# EAGLE board mf_tray_mb_v9 (EAGLE 8.0.1)
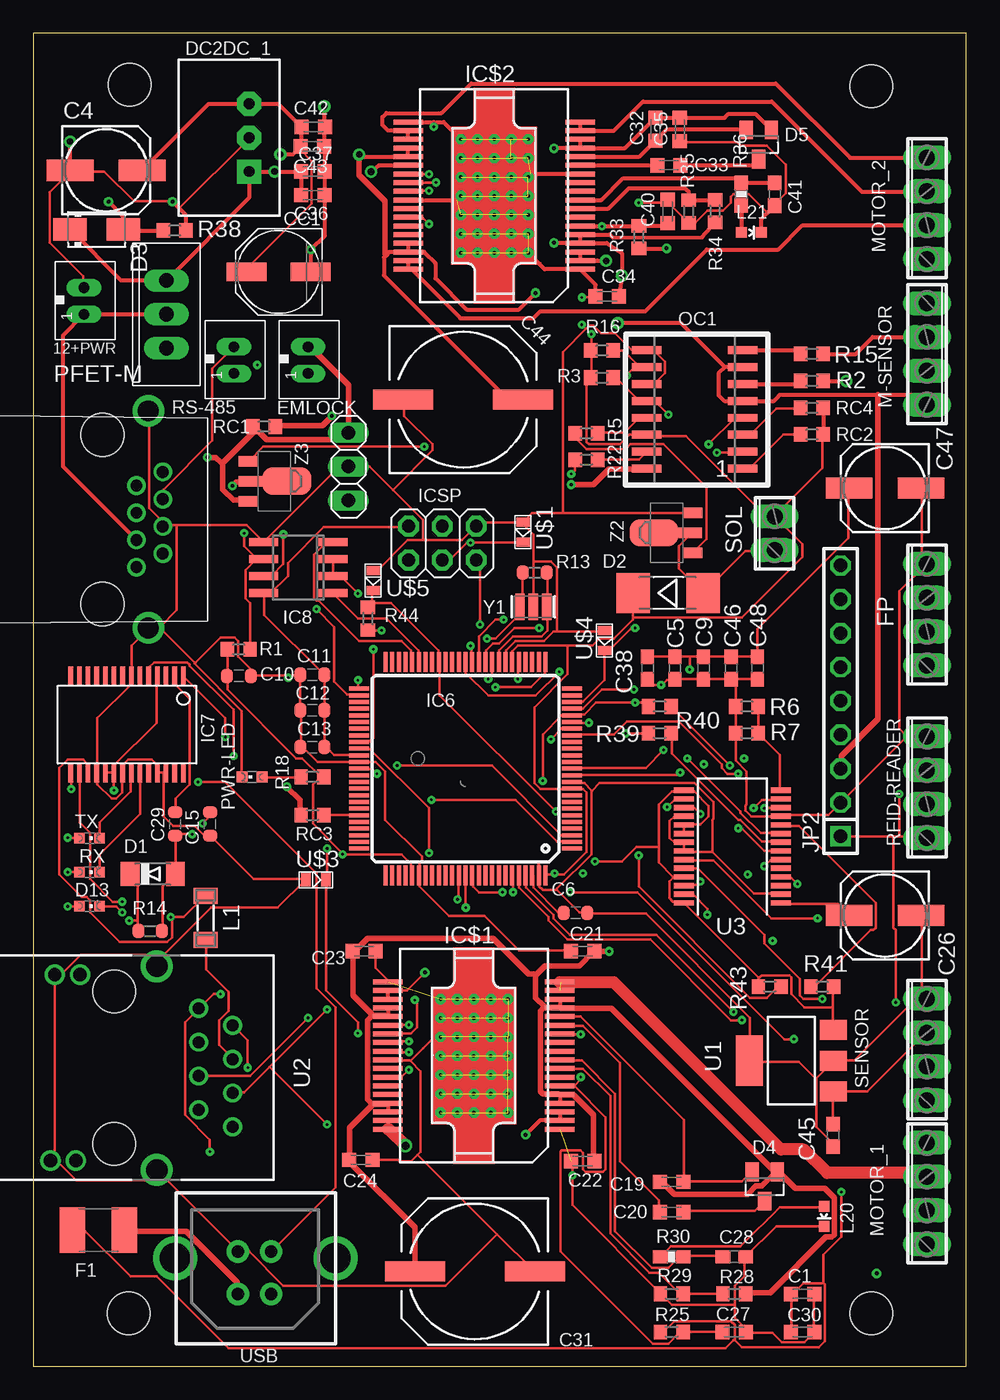
[diagram p8: board, top side]
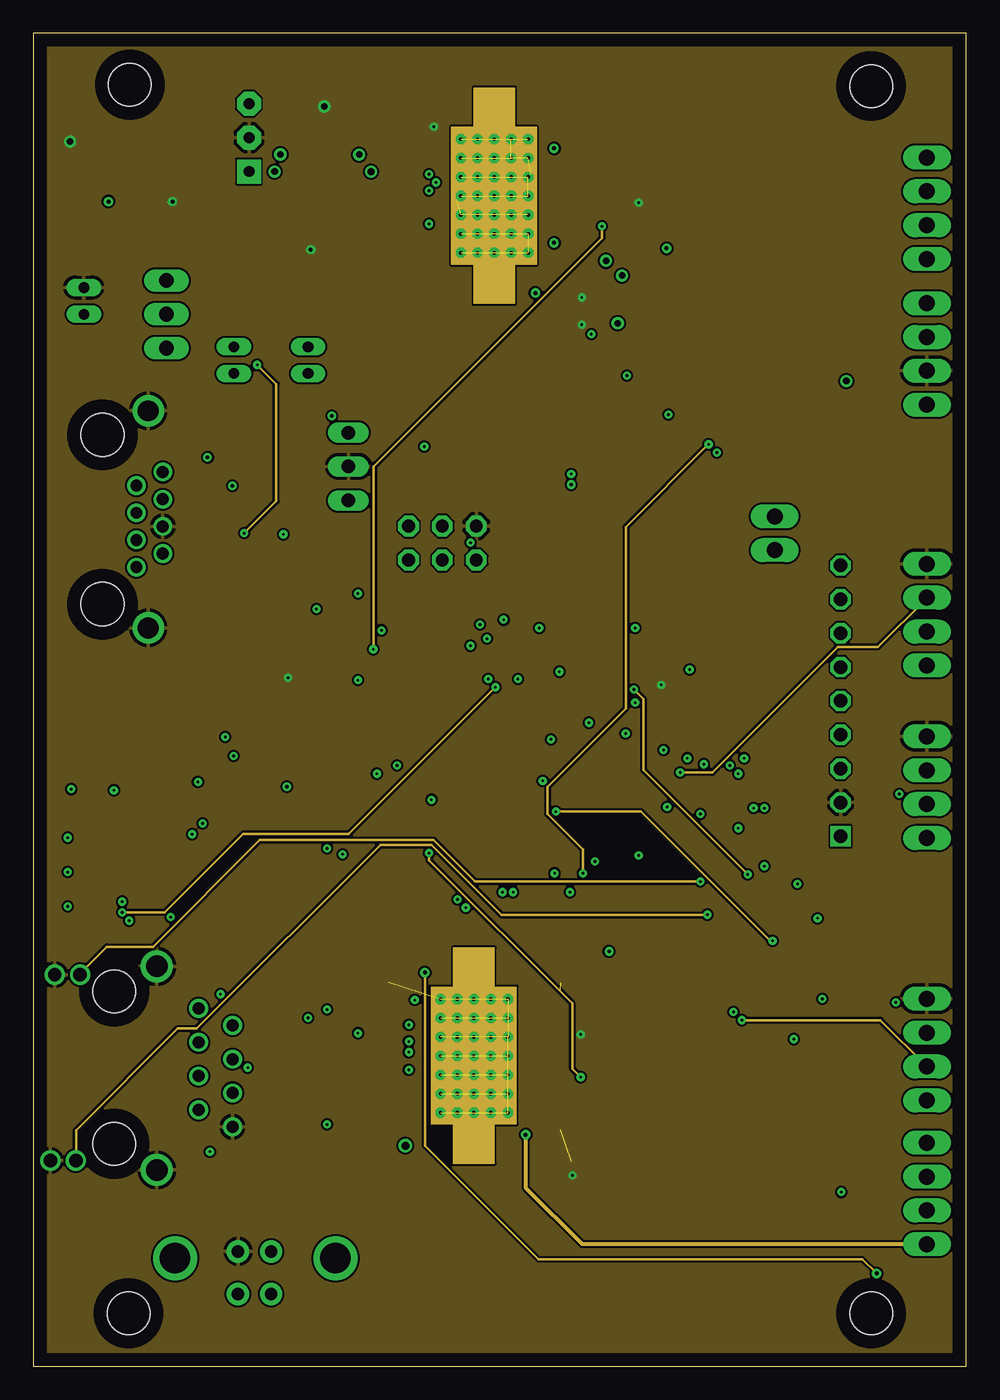
[diagram p9: board, inner layer Route2]
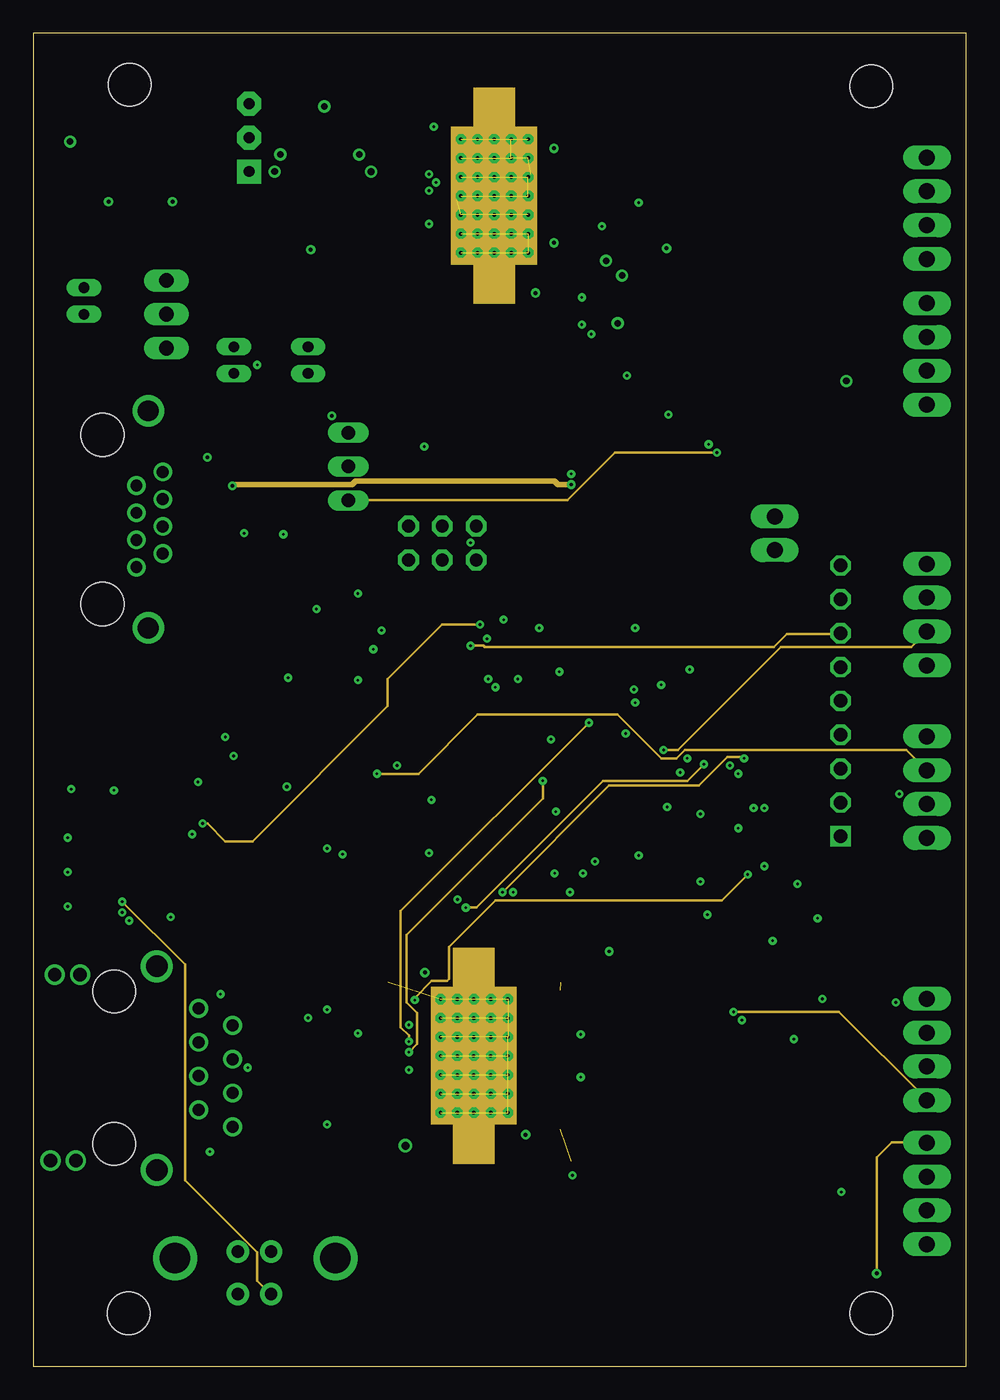
[diagram p10: board, inner layer Route15]
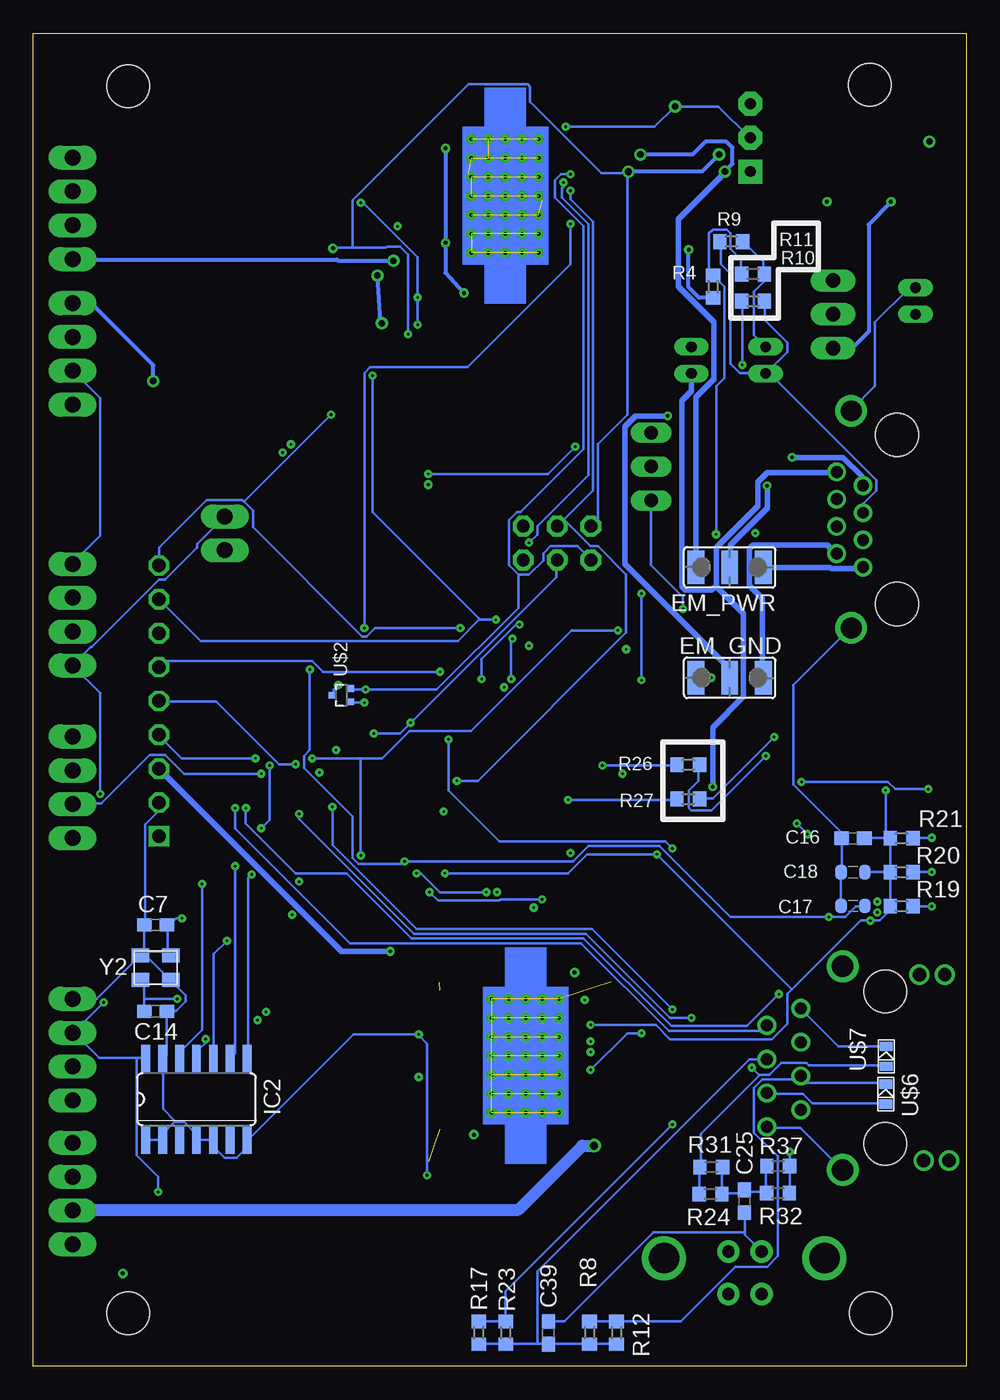
[diagram p11: board, bottom side, seen from below]

Size 70 x 100 mm. Coordinates in mm from the lower left corner, seen from the top.
Outline: 0,0 70,0 70,100 0,100 0,0
Copper layers (1+2*15+16): Top 0.035mm / dielectric 1.5mm / Route2 0.035mm / dielectric 0.15mm / Route15 0.035mm / dielectric 0.2mm / Bottom 0.035mm
Design rules "default *": minimum track width 8mil, minimum drill 8mil, track to track 6mil, track to pad 6mil, pad to pad 6mil, via to via 6mil, smd to smd 6mil, copper to edge 40mil, drill to drill 8mil, minimum pad ring 10mil, minimum via ring 8mil, stop-mask expansion 4mil, vias tented up to drill 0mil, thermal gap 10mil
Net classes: 1 power: width 0.406 mm, drill 0.254 mm, clearance 0.152 mm; 2 Massa: width 1.2 mm, drill 0.6 mm, clearance 0.2 mm; 3 Mot: width 1.2 mm, drill 0.8 mm, clearance 0.005 mm; 4 aref: width 0.305 mm, drill 0.61 mm, clearance 0.254 mm; 5 0.6096: width 0.61 mm, drill 0.406 mm, clearance 0.254 mm; 6 0.900: width 0.9 mm, drill 0.6 mm, clearance 0.5 mm
Holes 3.2 mm at 62.87,96.04 7.14,3.97 62.87,3.97 7.24,96.14

## Footprints (pad centres in the part's own frame; a part is rotated, then mirrored left to right if it is on the bottom)
JST_B2B-PH_HEADER = drill 0.8 long: P1 1.075,0.048; P2 -0.925,0.048
C0603K = smd 1.05 x 1.08: 1 -0.875,0; 2 0.875,0
153CLV-0605 = smd 3.5 x 1.6: + 2.7,0; - -2.7,0
C0603 = smd 1.1 x 1: 1 -0.85,0; 2 0.85,0
C0603-ROUND = smd 0.898 x 1.1: 1 -0.889,0; 2 0.889,0
NIC_10X10.5_CAP = smd 4.5 x 1.5: + 4.5,0; - -4.5,0
PANASONIC_D = smd 3 x 1.4: + 2.4,0; - -2.4,0
MINIMELF = smd 1.4 x 1.8: A 1.7,0; C -1.7,0
MELF-MLL41 = smd 2.5 x 3: A 2.625,0; C -2.625,0
DO214AC = smd 2.5 x 1.7: A 2,0; C -2,0
SOT23 = smd 1 x 1.4: 1 -0.95,-1.1; 2 0.95,-1.1; 3 0,1.1
CHIPLED_0603 = smd 0.8 x 0.8: A 0,-0.75; C 0,0.75
TSR-1 = drill 0.8 pad 1.8 square: 1 -2.54,-1.5 | drill 0.8 pad 1.8 octagon: 2 0,-1.5; 3 2.54,-1.5
SJ_2W = smd 1.27 x 2.54: 1 -2.54,0; 2 0,0; 3 2.54,0
L1812 = smd 1.9 x 3.4: 1 -1.95,0; 2 1.95,0
4POL254 = drill 1.2 long: 1 -3.81,0; 2 -1.27,0; 3 1.27,0; 4 3.81,0
SO14 = smd 0.66 x 2.032: 1 -3.81,-3.073; 2 -2.54,-3.073; 3 -1.27,-3.073; 4 0,-3.073; 5 1.27,-3.073; 6 2.54,-3.073; 7 3.81,-3.073; 8 3.81,3.073; 9 2.54,3.073; 10 1.27,3.073; 11 0,3.073; 12 -1.27,3.073; 13 -2.54,3.073; 14 -3.81,3.073
TQFP100 = smd 1.5 x 0.3: 1 -8,6; 2 -8,5.5; 3 -8,5; 4 -8,4.5; 5 -8,4; 6 -8,3.5; 7 -8,3; 8 -8,2.5; 9 -8,2; 10 -8,1.5; 11 -8,1; 12 -8,0.5; 13 -8,0; 14 -8,-0.5; 15 -8,-1; 16 -8,-1.5; 17 -8,-2; 18 -8,-2.5; 19 -8,-3; 20 -8,-3.5; 21 -8,-4; 22 -8,-4.5; 23 -8,-5; 24 -8,-5.5; 25 -8,-6; 51 8,-6; 52 8,-5.5; 53 8,-5; 54 8,-4.5; 55 8,-4; 56 8,-3.5; 57 8,-3; 58 8,-2.5; 59 8,-2; 60 8,-1.5; 61 8,-1; 62 8,-0.5; 63 8,0; 64 8,0.5; 65 8,1; 66 8,1.5; 67 8,2; 68 8,2.5; 69 8,3; 70 8,3.5; 71 8,4; 72 8,4.5; 73 8,5; 74 8,5.5; 75 8,6 | smd 0.3 x 1.5: 26 -6,-8; 27 -5.5,-8; 28 -5,-8; 29 -4.5,-8; 30 -4,-8; 31 -3.5,-8; 32 -3,-8; 33 -2.5,-8; 34 -2,-8; 35 -1.5,-8; 36 -1,-8; 37 -0.5,-8; 38 0,-8; 39 0.5,-8; 40 1,-8; 41 1.5,-8; 42 2,-8; 43 2.5,-8; 44 3,-8; 45 3.5,-8; 46 4,-8; 47 4.5,-8; 48 5,-8; 49 5.5,-8; 50 6,-8; 76 6,8; 77 5.5,8; 78 5,8; 79 4.5,8; 80 4,8; 81 3.5,8; 82 3,8; 83 2.5,8; 84 2,8; 85 1.5,8; 86 1,8; 87 0.5,8; 88 0,8; 89 -0.5,8; 90 -1,8; 91 -1.5,8; 92 -2,8; 93 -2.5,8; 94 -3,8; 95 -3.5,8; 96 -4,8; 97 -4.5,8; 98 -5,8; 99 -5.5,8; 100 -6,8
SSOP28DB = smd 0.348 x 1.397: 1 -4.225,-3.656; 2 -3.575,-3.656; 3 -2.925,-3.656; 4 -2.275,-3.656; 5 -1.625,-3.656; 6 -0.975,-3.656; 7 -0.325,-3.656; 8 0.325,-3.656; 9 0.975,-3.656; 10 1.625,-3.656; 11 2.275,-3.656; 12 2.925,-3.656; 13 3.575,-3.656; 14 4.225,-3.656; 15 4.225,3.656; 16 3.575,3.656; 17 2.925,3.656; 18 2.275,3.656; 19 1.625,3.656; 20 0.975,3.656; 21 0.325,3.656; 22 -0.325,3.656; 23 -0.975,3.656; 24 -1.625,3.656; 25 -2.275,3.656; 26 -2.925,3.656; 27 -3.575,3.656; 28 -4.225,3.656
SO-08 = smd 0.6 x 2.2: 1 -1.905,-2.6; 2 -0.635,-2.6; 3 0.635,-2.6; 4 1.905,-2.6; 5 1.905,2.6; 6 0.635,2.6; 7 -0.635,2.6; 8 -1.905,2.6
L6470_4L_2_15-POWERSO36 = smd 0.38 x 2.2: ADCIN 7.09,0.37; AGND 9.69,0.37; BUSY\SYNC 7.09,13.27; CK 9.04,13.27; CP 10.34,0.37; CS 6.44,13.27; DGND 7.74,13.27; FLAG 5.79,13.27; OSCIN 8.39,0.37; OSCOUT 9.04,0.37; OUT1A_1 3.19,0.37; OUT1A_2 3.84,0.37; OUT1B_1 12.94,0.37; OUT1B_2 13.59,0.37; OUT2A_1 3.19,13.27; OUT2A_2 2.54,13.27; OUT2B_1 12.94,13.27; OUT2B_2 12.29,13.27; PGND_1 2.54,0.37; PGND_2 13.59,13.27; SDI 8.39,13.27; SDO 9.69,13.27; STBY/RST 5.79,0.37; STCK 5.14,13.27; SW 6.44,0.37; VBOOT 10.99,0.37; VDD 10.34,13.27; VREG 7.74,0.37; VSA_1 4.49,0.37; VSA_2 5.14,0.37; VSA_3 4.49,13.27; VSA_4 3.84,13.27; VSB_1 11.64,0.37; VSB_2 12.29,0.37; VSB_3 11.64,13.27; VSB_4 10.99,13.27 | drill 0.254 octagon: GND_1 3.78,4.27; GND_2 5.2,4.27; GND_3 6.62,4.27; GND_4 8.04,4.27; GND_5 9.46,4.27; GND_6 10.88,4.27; GND_7 12.3,4.27; GND_8 12.3,5.545; GND_9 10.88,5.545; GND_10 9.46,5.545; GND_11 8.04,5.545; GND_12 6.62,5.545; GND_13 5.2,5.545; GND_14 3.78,5.545; GND_15 12.3,6.82; GND_16 10.88,6.82; GND_17 9.46,6.82; GND_18 8.04,6.82; GND_19 6.62,6.82; GND_20 5.2,6.82; GND_21 3.78,6.82; GND_22 3.78,8.07; GND_23 5.2,8.07; GND_24 6.62,8.07; GND_25 8.04,8.07; GND_26 9.46,8.07; GND_27 10.88,8.07; GND_28 12.3,8.07; GND_29 12.3,9.32; GND_30 10.88,9.32; GND_31 9.46,9.32; GND_32 8.04,9.32; GND_33 6.62,9.32; GND_34 5.2,9.32; GND_35 3.78,9.32
2X03 = drill 0.95 pad 1.55 octagon: 1 -2.54,-1.27; 2 -2.54,1.27; 3 0,-1.27; 4 0,1.27; 5 2.54,-1.27; 6 2.54,1.27
1X09 = drill 1.016 square: 1 -10.16,0 | drill 1.016 octagon: 2 -7.62,0; 3 -5.08,0; 4 -2.54,0; 5 0,0; 6 2.54,0; 7 5.08,0; 8 7.62,0; 9 10.16,0
SM-1206 = smd 1.2 x 1.8: 1 -1.65,0; 2 1.65,0
LED-0603 = smd 0.8 x 0.8: A 0,-0.75; C 0,0.75
SOP16 = smd 0.6 x 2.2: 1 -4.455,-3.6; 2 -3.185,-3.6; 3 -1.915,-3.6; 4 -0.645,-3.6; 5 0.625,-3.6; 6 1.895,-3.6; 7 3.165,-3.6; 8 4.435,-3.6; 9 4.435,3.6; 10 3.165,3.6; 11 1.895,3.6; 12 0.625,3.6; 13 -0.645,3.6; 14 -1.915,3.6; 15 -3.185,3.6; 16 -4.455,3.6
FQP47P06-NORMAL = drill 1.118 long: 1 2.54,-2.54; 2 5.08,-2.54; 3 7.62,-2.54
R0603@1 = smd 1 x 1.1: 1 -0.85,0; 2 0.85,0
R0603 = smd 1 x 1.1: 1 -0.85,0; 2 0.85,0
R0603-ROUND = smd 0.898 x 1.1: 1 -0.889,0; 2 0.889,0
0603-RES = smd 1.1 x 1: 1 -0.85,0; 2 0.85,0
2POL254 = drill 1.2 long: 1 -1.27,0; 2 1.27,0
SOT223 = smd 1.5 x 2: 1 -3.57,-3.15; 2 -1.27,-3.15; 3 1.03,-3.15 | smd 3.8 x 2: 4 -1.27,3.15
5-6605758-1 = drill 0.9 pad 1.3: 1 -4.445,0; 2 -3.175,2.54; 3 -1.905,0; 4 -0.635,2.54; 5 0.635,0; 6 1.905,2.54; 7 3.175,0; 8 4.445,2.54 | drill 1 pad 1.422: D1 -6.973,-8.902; D2 -6.973,-10.807; D3 6.973,-9.219; D4 6.973,-11.124 | drill 1.6 pad 2.184: M1 7.683,-3.141; M2 -7.603,-3.141 | hole 3.2: 5.715,-6.35; -5.715,-6.35
SSOP28 = smd 0.4 x 1.5: 1 -4.225,-3.625; 2 -3.575,-3.625; 3 -2.925,-3.625; 4 -2.275,-3.625; 5 -1.625,-3.625; 6 -0.975,-3.625; 7 -0.325,-3.625; 8 0.325,-3.625; 9 0.975,-3.625; 10 1.625,-3.625; 11 2.275,-3.625; 12 2.925,-3.625; 13 3.575,-3.625; 14 4.225,-3.625; 15 4.225,3.625; 16 3.575,3.625; 17 2.925,3.625; 18 2.275,3.625; 19 1.625,3.625; 20 0.975,3.625; 21 0.325,3.625; 22 -0.325,3.625; 23 -0.975,3.625; 24 -1.625,3.625; 25 -2.275,3.625; 26 -2.925,3.625; 27 -3.575,3.625; 28 -4.225,3.625
1X03 = drill 1.016 long: 1 -2.54,0; 2 0,0; 3 2.54,0
0402 = smd 0.7 x 1: A -0.5,0; C 1,0
SOT416 = smd 0.5 x 0.6: 1 -0.5,-0.65; 2 0.5,-0.65; 3 0,0.65
RJ45-TOP = drill 0.89: 1 3.58,2.54; 2 2.56,4.52; 3 1.54,2.54; 4 0.52,4.52; 5 -0.5,2.54; 6 -1.52,4.52; 7 -2.54,2.54; 8 -3.56,4.52 | drill 1.57: GND1 -8.15,3.43; GND2 8.13,3.43 | hole 3.25: -6.35,0; 6.35,0
USB-B-PTH-VERTICAL = drill 0.914 pad 1.676: D+ 4.826,4.394; D- 4.826,7.595; GND 7.315,4.394; VBUS 7.315,7.595 | drill 2.286: P$1 0,4.902; P$2 12.04,4.902
RESONATOR = smd 0.7 x 2: 1 -1,0; 2 0,0; 3 1,0
CRYSTAL-3.2-2.5 = smd 1.3 x 1.05: 1 -1.15,-0.925; 2 1.15,-0.925; 3 1.15,0.925; 4 -1.15,0.925
SOT89 = smd 0.8 x 1.4: 1 -1.499,-1.981; 3 1.499,-1.981 | smd 0.8 x 1.9: 2 0,-1.727 | smd 2.032 x 3.65: 2@1 0,0.94

## Placement (x,y rotation side)
12+PWR  [JST_B2B-PH_HEADER]  3.75,80 270 top
C1  100n  [C0603K]  57.72,5.43 180 top
C4  10u  [153CLV-0605]  5.47,89.72 0 top
C5  100n  [C0603]  48.14,52.38 270 top
C6  100n  [C0603-ROUND]  40.69,34.01 0 top
C7  22p  [C0603]  60.82,33.11 180 bottom
C9  100n  [C0603]  50.28,52.38 270 top
C10  100n  [C0603-ROUND]  15.42,51.79 0 top
C11  100n  [C0603-ROUND]  20.94,51.87 180 top
C12  100n  [C0603-ROUND]  20.94,49.21 180 top
C13  100n  [C0603-ROUND]  20.94,46.45 180 top
C14  22p  [C0603]  60.82,26.62 0 bottom
C15  22p  [C0603-ROUND]  13.25,40.67 270 top
C16  100n  [C0603]  8.49,39.6 180 bottom
C17  100n  [C0603-ROUND]  8.49,34.52 0 bottom
C18  100n  [C0603-ROUND]  8.49,37.06 180 bottom
C19  220n  [C0603K]  47.9,13.83 180 top
C20  10n  [C0603K]  47.9,11.57 0 top
C21  100n  [C0603K]  41.24,31.13 0 top
C22  100n  [C0603K]  41.24,15.38 0 top
C23  100n  [C0603K]  24.82,31.13 180 top
C24  100n  [C0603K]  24.59,15.48 180 top
C25  10n  [C0603]  16.65,12.38 270 bottom
C26  10u  [153CLV-0605]  63.9,33.82 180 top
C27  1n  [C0603K]  52.59,2.57 180 top
C28  10uF  [C0603]  52.59,8.21 0 top
C29  100n  [C0603-ROUND]  10.63,40.67 270 top
C30  1u  [C0603K]  57.71,2.57 180 top
C31  100uF  [NIC_10X10.5_CAP]  33.14,7.11 180 top
C32  220n  [C0603K]  46.68,92.81 90 top
C33  10n  [C0603K]  47.69,90.1 0 top
C34  100n  [C0603K]  43.07,80.25 0 top
C35  100n  [C0603K]  48.51,92.79 90 top
C36  100n  [C0603K]  20.97,87.86 180 top
C37  100n  [C0603K]  20.96,89.65 180 top
C38  100n  [C0603]  46.08,52.38 270 top
C39  100n  [C0603]  31.34,2.49 90 bottom
C40  1n  [C0603K]  47.6,86.63 270 top
C41  10uF  [C0603]  55.64,87.92 270 top
C42  100n  [C0603K]  21,92.96 180 top
C43  1u  [C0603K]  20.94,91.52 180 top
C44  100uF  [NIC_10X10.5_CAP]  32.25,72.52 0 top
C45  100n  [C0603]  60.01,17.32 270 top
C46  100n  [C0603]  52.35,52.38 270 top
C47  10u  [153CLV-0605]  63.9,65.88 180 top
C48  100n  [C0603]  54.33,52.38 270 top
CC1  47u  [PANASONIC_D]  18.42,82.1 180 top
D1  CD1206  [MINIMELF]  8.96,36.93 0 top
D2  SM4007  [MELF-MLL41]  47.63,58.01 0 top
D3  [DO214AC]  4.76,85.29 0 top
D4  BAV99  [SOT23]  54.88,13.48 180 top
D5  BAV99  [SOT23]  54.43,91.66 180 top
D13  [CHIPLED_0603]  4.21,34.52 270 top
DC2DC_1  TSR1-2450  [TSR-1]  14.69,92.17 90 top
EM_GND  [SJ_2W]  17.75,51.65 0 bottom
EM_PWR  [SJ_2W]  17.75,59.94 0 bottom
EMLOCK  [JST_B2B-PH_HEADER]  20.57,75.56 270 top
F1  500mA  [L1812]  4.89,10.22 0 top
FP  2.5mm  [4POL254]  67.06,56.39 90 top
IC2  74ACT125D  [SO14]  57.76,20.03 0 bottom
IC6  [TQFP100]  32.43,44.83 180 top
IC7  FT232RL  [SSOP28DB]  7.04,48.14 180 top
IC8  MAX485  [SO-08]  19.89,59.92 90 top
IC$1  L6470L6470_4L_2_15  [L6470_4L_2_15-POWERSO36]  39.88,15.24 90 top
IC$2  L6470L6470_4L_2_15  [L6470_4L_2_15-POWERSO36]  41.4,79.76 90 top
ICSP  [2X03]  30.7,61.76 0 top
JP2  [1X09]  60.58,49.91 90 top
L1  Ferrit Bead  [SM-1206]  12.93,33.65 90 top
L20  Amber  [LED-0603]  59.34,11.25 180 top
L21  Amber  [LED-0603]  53.89,85.05 270 top
M-SENSOR  [4POL254]  67.06,75.95 270 top
MOTOR_1  M1  [4POL254]  67.06,12.95 90 top
MOTOR_2  M2  [4POL254]  67.06,86.87 90 top
OC1  ACPL-247  [SOP16]  49.62,71.8 90 top
PFET-M  [FQP47P06-NORMAL]  7.45,73.84 90 top
PWR-LED  [CHIPLED_0603]  16.42,44.21 90 top
R1  4.7k  [R0603@1]  15.42,53.79 180 top
R2  2.2k  [R0603@1]  58.42,73.91 0 top
R3  1k  [R0603@1]  42.67,74.17 0 top
R4  4.7k  [R0603@1]  19,81 90 bottom
R5  330  [R0603@1]  41.5,70 0 top
R6  2k7  [R0603]  53.54,47.5 180 top
R7  15k  [R0603]  53.54,49.5 180 top
R8  100R  [R0603]  28.27,2.49 270 bottom
R9  120  [R0603@1]  17.64,84.37 180 bottom
R10  10  [R0603@1]  16,79.9 180 bottom
R11  10  [R0603@1]  16,81.93 180 bottom
R12  100R  [R0603]  26.24,2.49 270 bottom
R13  1M  [R0603-ROUND]  37.62,59.54 0 top
R14  10K  [R0603-ROUND]  8.77,32.66 180 top
R15  2.2k  [R0603@1]  58.42,75.95 0 top
R16  1k  [R0603@1]  42.67,76.2 0 top
R17  100R  [R0603]  36.59,2.49 270 bottom
R18  1k  [R0603@1]  20.94,44.21 0 top
R19  1k  [R0603@1]  4.85,34.52 180 bottom
R20  1k  [R0603@1]  4.85,37.06 0 bottom
R21  1k  [R0603@1]  4.85,39.6 0 bottom
R22  330  [R0603@1]  41.5,68 0 top
R23  100R  [R0603]  34.55,2.49 270 bottom
R24  100R  [R0603]  19.18,12.92 180 bottom
R25  10k  [R0603]  47.9,2.57 180 top
R26  1k  [R0603@1]  20.86,45.12 180 bottom
R27  1k  [R0603@1]  20.86,42.55 180 bottom
R28  2.7k  [R0603]  52.59,5.43 0 top
R29  51k  [R0603]  47.9,5.43 0 top
R30  1K  [0603-RES]  47.9,8.21 0 top
R31  100R  [R0603]  19.13,14.95 180 bottom
R32  100R  [R0603]  14.11,12.98 0 bottom
R33  10k  [R0603]  45.44,84.71 270 top
R34  2.7k  [R0603]  51.15,86.65 270 top
R35  51k  [R0603]  49.18,86.63 90 top
R36  1K  [0603-RES]  53.12,87.93 90 top
R37  100R  [R0603]  14.11,15.02 0 bottom
R38  1k  [R0603]  10.61,85.21 0 top
R39  100R  [R0603]  47,47.5 180 top
R40  100R  [R0603]  47,49.5 180 top
R41  10k  [R0603]  59.19,28.47 0 top
R43  10k  [R0603]  55.26,28.48 180 top
R44  100R  [R0603]  25.11,56.08 90 top
RC1  1k  [R0603@1]  17.32,70.5 180 top
RC2  470  [R0603@1]  58.42,69.9 0 top
RC3  1k  [R0603@1]  20.94,41.34 0 top
RC4  470  [R0603@1]  58.42,71.89 0 top
RFID-READER  ID-12LA  [4POL254]  67.06,43.43 90 top
RS-485  [JST_B2B-PH_HEADER]  15,75.56 270 top
RX  GREEN  [CHIPLED_0603]  4.21,37.06 270 top
SENSOR  SENSOR  [4POL254]  67.06,23.75 90 top
SOL  [2POL254]  55.63,62.48 90 top
TX  YELLOW  [CHIPLED_0603]  4.21,39.6 270 top
U1  TC1262-33VDB  [SOT223]  56.88,24.19 90 top
U2  Tyco 5-6605758-1  [5-6605758-1]  12.41,22.4 270 top
U3  ENC28J60-SSOP  [SSOP28]  52.45,38.98 90 top
U3V12F12  EM_CTRL  [1X03]  23.65,67.5 90 top
U$1  GG0402050R3C2P  [0402]  36.76,62.83 270 top
U$2  RCLAMP0582BQ  [SOT416]  46.88,50.34 90 bottom
U$3  GG0402050R3C2P  [0402]  20.94,36.5 0 top
U$4  GG0402050R3C2P  [0402]  42.87,54.69 270 top
U$5  GG0402050R3C2P  [0402]  25.5,59.19 270 top
U$6  GG0402050R3C2P  [0402]  6.03,20.16 90 bottom
U$7  GG0402050R3C2P  [0402]  6,23 90 bottom
U$10  RJ45-TOP-1-406541-1-CAN-MB  [RJ45-TOP]  5.2,63.53 270 top
USB  USB  [USB-B-PTH-VERTICAL]  22.67,13 180 top
Y1  [RESONATOR]  37.52,56.97 180 top
Y2  25MHz  [CRYSTAL-3.2-2.5]  60.82,29.9 0 bottom
Z2  ZXTN2010Z  [SOT89]  47.51,62.53 90 top
Z3  ZXTN2010Z  [SOT89]  18.1,66.4 270 top

## Tracks (layer width: path | path; a pad name or v marks a point on that pad's centre or on a via)
12PWR+  (via drill 0.25, 0.3, 0.5)
  Top 0.3: IC$2.VSB_2 IC$2.VSB_1 | IC$2.VSA_1 IC$2.VSA_2 43.26,84.9 43.48,84.68 50.18,84.69 R34.2 | IC$2.VSA_3 IC$2.VSA_4 | C36.2 20.1,89.64 C37.2 20.07,89.63 v18.11,89.63 DC2DC_1.1 | 16.2,89.65 DC2DC_1.1 | v24.45,90.9 24.6,90.75 IC$2.VSB_4 IC$2.VSB_3 | D3.C 6.59,81.46 PFET-M.3 16.19,87.66 DC2DC_1.1 | IC$2.VSB_1 44.39,91.4 C32.2 48.49,93.69 C35.2 51.87,93.66 52.17,93.96 54.18,93.96 D5.1 | IC$2.VSA_1 43.02,84.27 44.15,83.51 v44.18,81.83 C34.2 | M-SENSOR.4 66.31,72.88 63.39,72.88 56,72.88 55.93,72.81 55.93,72.79 55.56,72.42 OC1.5 51.85,72.41 51.42,72.84 51.42,74.49 51.89,74.96 | OC1.7 51.89,74.96 | 51.89,74.96 48.6,78.25 v43.85,78.25 | IC$2.VSA_4 29.32,83.6 30.17,82.75 30.17,81.63 32.52,79.28 36.45,79.28 v37.68,80.51 | IC$2.VSB_1 39.1,91.4 v39.07,91.37 | IC$2.VSA_1 39.1,84.25 v39.07,84.28 | IC$2.VSA_4 26.73,83.6 26.5,83.38 26.31,83.18 26.31,81.82 35.66,72.47 36.7,72.47 C44.+ | IC$1.VSA_2 IC$1.VSA_1 | IC$1.VSB_2 IC$1.VSB_1 | IC$1.VSB_3 IC$1.VSB_4 | IC$1.VSA_3 IC$1.VSA_4
  Top 0.406: C19.2 47.03,13.78 47.21,13.78 48.09,12.89 53.61,12.89 54.23,13.51 54.67,13.51 55.74,14.58 D4.1 | R28.2 53.52,5.51 55.3,5.51 59.47,9.69 59.92,9.69 60.1,9.87 60.1,12.62 59.38,13.34 57.16,13.34 56.01,14.49 D4.1 | 37.69,29.34 38.41,30.05 40.98,30.05 42.05,31.11 C21.2 42.32,31.11 v43.2,31.11 | 37.69,29.34 37.69,27.65 38.36,26.98 | 38.36,26.98 38.41,26.94 39.47,26.94 IC$1.VSB_1 39.65,26.85 43.38,26.85 55.56,14.67 D4.1 | C22.2 42.05,15.38 42.05,18.85 40.54,20.36 39.56,20.36 IC$1.VSA_2 39.38,20.45 38.23,20.45 38.05,20.62 38.05,26.67 38.36,26.98 | 25.47,19.6 25.51,19.65 26.58,19.65 IC$1.VSA_3 | 25.47,19.6 23.74,17.87 23.74,15.56 C24.2 23.74,15.29 28.63,10.4 28.63,7.11 C31.+ | 25.47,26.36 25.51,26.31 26.58,26.31 IC$1.VSB_4 | 25.47,26.36 24,27.83 24,31.11 C23.2 24.18,31.2 25.07,32.09 34.49,32.09 37.16,29.43 37.52,29.43 37.69,29.34 | 25.47,19.6 25.07,20 25.07,25.96 25.47,26.36 | 63.39,72.88 63.39,48.54 60.63,45.78 60.63,44.9 JP2.3 | 26.5,83.38 26.4,83.48 26.4,87.39 24.45,89.34 24.45,90.77 v24.45,90.9
  Bottom 0.3: v18.11,89.63 17.54,90.2 17.54,91.42 17.98,91.86 19.57,91.86 20.53,90.9 v24.45,90.9 | v43.85,78.25 43.95,78.35 v44.18,81.83 | v37.68,80.51 39.08,82.03 v39.07,84.28 v39.07,91.37
  Bottom 0.406: EM_PWR.1 20.27,60.01 20.27,72.72 18.94,74.05 18.94,78.32 21.6,80.99 21.6,86.06 18.14,89.52 v18.11,89.63 | v43.2,31.11 46.85,31.11 60.54,44.81 JP2.3
12PWR+DIODE
  Top 0.3: PFET-M.2 12+PWR.P1 2.23,77.35 2.23,67.5 U$10.3
+3V3  (via drill 0.2)
  Top 0.203: C38.1 46.14,53.25 48.09,53.25 C5.1 48.18,53.25 49.25,53.25 | 49.25,53.25 50.23,53.25 C9.1 50.32,53.25 52.27,53.25 C46.1 52.45,53.25 54.32,53.25 C48.1 54.32,53.34 54.32,55.3 61.16,62.14 61.16,65.88 C47.+ | L1.2 12.89,35.29 11.29,33.69 v10.31,33.69 10.4,33.6 10.4,32.18 10.05,31.83 6.49,31.83 4.27,34.05 4.27,34.94 4,35.2 3.65,35.2 1.96,36.89 1.96,44.9 2.58,45.52 3.73,45.52 4.09,45.16 4.09,44.54 IC7.17 | U3.20 48.81,40.01 48.81,40.54 U3.19 48.9,40.63 50.05,40.63 50.67,41.25 50.67,42.05 49.61,43.12 48.9,43.12 U3.15 48.81,43.12 47.92,43.12 46.94,42.14 46.94,38.94 | 60.01,26.94 60.01,25.25 U1.3 | 60.01,26.94 60.01,28.45 R41.2 | 54.41,29.16 54.41,28.54 R43.2 | 54.41,29.16 48.9,34.67 U3.28 48.81,34.85 48.01,34.85 47.74,35.12 47.74,36.36 48.01,36.63 | 48.01,36.63 48.81,36.63 U3.25 | 60.01,26.94 57.87,26.94 56.9,27.91 56.9,29.16 56.72,29.34 54.67,29.34 54.5,29.16 54.41,29.16 | 46.94,38.94 46.94,37.78 48.01,36.72 48.01,36.63 | v42.14,37.87 44.18,37.87 45.25,38.94 46.94,38.94 | v49.25,52.27 49.25,53.25
  Bottom 0.203: C17.2 7.64,34.49 8.27,34.49 9.07,33.69 v10.31,33.69 17.69,33.69 23.02,39.03 28.36,39.03 29.52,37.87 v42.14,37.87 42.23,37.87 42.41,37.69 45.61,37.69 46.05,38.14 46.05,41.25 49.7,44.9 49.7,45.78 49.25,46.23 v49.25,52.27
+5V  (via drill 0.2, 0.3, 0.5)
  Top 0.203: C30.2 56.9,2.58 56.9,5.42 C1.2 56.98,5.42 57.78,6.22 59.3,6.22 | 52.63,1.96 52.63,3.11 52.36,3.38 48.09,3.38 47.3,2.58 47.12,2.58 R25.2 | 52.63,1.96 53.16,1.42 58.94,1.42 59.38,1.87 59.38,6.13 59.3,6.22 | F1.1 3.02,10.13 3.91,10.13 7.29,6.76 9.25,6.76 14.67,1.33 51.92,1.33 52.54,1.96 52.63,1.96 | CC1.+ 16.09,82.14 16.09,82.41 20.89,87.21 20.89,90.41 20,91.3 C43.2 | IC6.61 24.36,45.87 22.58,45.87 21.96,46.49 C13.1 21.87,46.49 21.87,49.16 C12.1 21.87,49.25 21.87,51.83 C11.1 21.78,51.92 17.34,56.36 17.34,57.96 IC8.8 17.42,57.96 17.78,57.96 19.11,59.3 19.11,60.27 21.78,62.94 28.09,62.94 ICSP.2 | R1.2 14.58,51.83 C10.1 14.58,51.74 14.58,50.76 19.74,45.61 20.18,45.61 21.51,44.27 21.78,44.27 R18.2 21.51,44.18 20.98,43.65 20.98,40.72 23.29,38.41 | 23.29,38.41 27.65,38.41 28.36,37.69 28.36,36.89 IC6.80 | IC7.19 5.42,44.54 6.04,44.54 IC7.20 | IC7.4 9.25,51.74 9.25,48.27 6.04,45.07 6.04,44.63 IC7.20 | 7.82,33.43 7.82,36.36 7.29,36.89 D1.C | 7.82,33.43 7.82,32.72 R14.2 | v28.18,25.6 26.67,25.6 IC$1.VDD | v7.2,33.43 7.82,33.43 | v6.04,43.2 6.04,44.45 IC7.20 | v23.2,38.41 23.29,38.41 | 39.12,36.89 39.83,36.89 41.52,38.58 41.52,43.03 41.25,43.29 40.45,43.29 IC6.10 40.36,43.29 38.05,43.29 37.6,43.74 37.6,49.43 40.09,51.92 40.09,54.05 | 39.12,36.89 38.49,36.89 IC6.100 | 40.09,54.05 41.96,54.05 42.49,54.59 43.56,54.59 44.98,56.01 44.98,56.19 | 40.09,54.05 36.36,54.05 35.92,53.61 35.92,52.9 IC6.31 | 44.98,56.19 44.98,57.96 D2.C | v41.87,77.43 41.87,76.28 R16.1 41.87,76.19 41.87,74.23 R3.1 41.78,74.14 41.52,73.88 41.52,69.34 41.69,69.16 44.01,69.16 44.72,69.88 45.96,69.88 OC1.14 46.05,69.79 48.98,69.79 54.94,63.83 55.56,63.83 SOL.2
  Top 0.203: C45.1 60.01,18.22 60.01,20.54 U1.1 60.1,20.62 62.59,20.62 67.03,25.07 SENSOR.3 | 64.99,39.74 66.94,39.74 RFID-READER.1 | 64.99,39.74 64.54,39.74 | 64.54,39.74 60.63,39.74 JP2.1 | RC2.2 59.21,69.79 59.21,67.39 55.65,63.83 SOL.2 | v64.99,42.94 64.99,39.74 | v64.72,27.29 64.72,32.72 64.54,32.89 64.54,39.74 | 44.98,56.19 53.16,56.19 57.7,60.72 57.7,61.7 55.65,63.74 SOL.2 | v39.12,36.98 39.12,36.89 | 59.3,6.22 59.3,8.36 60.63,9.69 v60.63,13.07
  Top 0.3: v18.54,90.91 19.46,90.91 C43.2 20.08,92.61 C42.2 18.38,94.71 DC2DC_1.3 13.16,94.71 C4.+ | v25.34,89.62 25.94,90.1 IC$2.VDD | RC4.2 RC2.2 | R33.2 v47.51,83.86 v47.52,83.87
  Bottom 0.203: ICSP.2 28.09,63.03 27.65,63.48 27.65,69.16 25.43,71.39 25.43,89.52 v25.34,89.62 25.51,89.52 27.38,89.52 32.72,94.86 32.72,96.01 32.89,96.19 37.34,96.19 46.05,87.48 46.05,83.92 | R21.1 5.78,39.65 7.56,39.65 C16.1 | R20.1 5.69,36.98 5.69,34.58 R19.2 5.78,34.49 5.78,34.14 6.49,33.43 v7.2,33.43 7.91,33.43 13.07,28.27 | C18.1 7.56,37.07 5.78,37.07 R20.1 | R21.1 5.69,39.56 5.69,37.16 R20.1 | v28.18,25.6 23.29,25.6 22.23,24.54 14.58,24.54 13.42,25.69 13.42,27.91 13.07,28.27 | v6.04,43.2 6.04,39.74 R21.1 | 13.07,28.27 v23.2,38.41 28.45,38.41 29.87,36.98 v39.12,36.98 | 46.05,83.92 43.56,83.92 43.47,84.01 42.49,84.01 41.87,83.39 v41.87,77.43 | 46.05,83.92 47.47,83.92 v47.52,83.87 | 62.23,23.11 65.08,23.11 67.03,25.07 SENSOR.3 66.94,25.07 v64.72,27.29 | 62.23,23.11 61.61,23.11 IC2.14 | SOL.2 55.65,63.74 57.7,61.7 57.7,61.43 60.1,59.03 60.54,59.03 65.61,53.96 65.7,53.96 67.03,52.63 FP.1 67.03,52.54 64.99,50.49 v64.99,42.94 | v60.63,13.07 60.63,14.22 62.23,15.82 62.23,23.11
  Bottom 0.3: v18.54,90.91 19.83,89.62 v25.34,89.62
A8  (via drill 0.2)
  Top 0.203: v35.2,35.56 33.43,35.56 32.98,36.01 32.98,36.8 IC6.89
  Route15 0.203: v35.2,35.56 43.2,43.56 49.96,43.56 52.09,45.7 53.25,45.7 v53.34,45.61
  Bottom 0.203: v53.34,45.61 58.85,45.61 60.54,47.3 JP2.4
A9  (via drill 0.2)
  Top 0.203: v32.45,34.4 32.45,36.8 IC6.88
  Route15 0.203: v32.45,34.4 33.25,34.4 42.76,43.92 49.07,43.92 v50.32,45.16
  Bottom 0.203: v50.32,45.16 51.56,45.16 56.27,49.87 60.54,49.87 JP2.5
ADCIN_1
  Top 0.203: R28.1 48.81,5.42 R29.2 48.72,5.51 48.45,5.51 46.94,7.02 46.23,7.02 43.29,9.96 43.29,20.27 41.25,22.31 39.56,22.31 IC$1.ADCIN
ADCIN_2
  Top 0.3: IC$2.ADCIN 43.15,86.85 44.68,88.38 48.9,88.38 49.16,88.12 49.16,87.5 R35.2 51.13,87.48 R34.1
AREF
  Top 0.203: C6.1 39.74,34.05 39.38,34.05 37.52,35.92 37.52,36.8 IC6.98
CS  (via drill 0.2)
  Top 0.203: U$5.C 25.43,58.14 25.43,57.25 25.16,56.98 R44.2 25.51,57.25 26.85,57.25 30.4,53.7 30.4,52.9 IC6.42 30.49,52.81 30.49,50.32 v39.2,41.6
  Route2 0.203: v55.47,31.91 55.3,31.91 45.61,41.6 v39.2,41.6
  Bottom 0.203: v55.47,31.91 56.45,30.94 56.45,23.11 IC2.10
CS_1  (via drill 0.2)
  Top 0.203: v24.36,24.98 24.36,25.78 21.96,28.18 21.96,36.45 U$3.C 22.05,36.45 v22.05,38.85 | v28.18,22.23 27.65,21.69 26.67,21.69 IC$1.CS | v38.85,47.03 39.65,47.83 40.36,47.83 IC6.19
  Bottom 0.203: v24.36,24.98 25.43,24.98 v28.18,22.23 | v38.85,47.03 38.85,43.2 35.03,39.38 22.58,39.38 v22.05,38.85
CS_2  (via drill 0.2)
  Top 0.203: IC6.23 40.45,49.87 41.25,49.87 42.85,51.47 42.85,53.61 U$4.C 42.94,53.7 43.2,53.7 44.9,55.38 v45.16,55.38 | v29.69,85.7 29.25,86.14 28.18,86.14 IC$2.CS
  Bottom 0.203: v29.69,85.7 29.69,82.68 37.43,74.94 44.72,74.94 45.16,74.5 v45.16,55.38
D46  (via drill 0.2)
  Top 0.203: v39.47,52.09 37.69,50.32 34.14,50.32 32.45,52.01 32.45,52.81 IC6.38
  Bottom 0.203: v39.47,52.09 48.27,52.09 49.07,52.9 60.1,52.9 60.54,52.45 JP2.6
D47  (via drill 0.2)
  Top 0.203: v32.8,54.05 32.89,53.96 32.89,52.9 IC6.37
  Route15 0.203: v32.8,54.05 33.78,54.05 33.87,53.96 55.56,53.96 56.54,54.94 60.54,54.94 JP2.7
D48  (via drill 0.2)
  Top 0.203: R16.2 43.56,76.19 44.27,76.19 45.43,75.03 45.96,75.03 OC1.10 45.25,75.12 44.54,74.41 v44.54,74.32 | v35.29,56.01 34.67,56.01 33.43,54.76 33.43,52.9 IC6.36
  Bottom 0.203: 36.54,56.01 v35.29,56.01 | 36.54,56.01 38.14,54.41 57.43,54.41 60.54,57.52 JP2.8 | v44.54,74.32 44.54,64.1 36.54,56.1 36.54,56.01
D49  (via drill 0.2)
  Top 0.203: R3.2 43.56,74.14 43.74,74.14 45.43,72.45 45.96,72.45 OC1.12 46.05,72.36 46.67,72.36 v47.65,71.39 | v37.96,55.38 36.09,55.38 34.94,54.23 34.49,54.23 33.96,53.7 33.96,52.9 IC6.35
  Bottom 0.203: v37.96,55.38 44.36,55.38 44.98,54.76 45.34,54.76 53.52,62.94 53.52,64.19 54.19,64.85 | 54.19,64.85 54.32,64.99 56.98,64.99 60.54,61.43 60.54,60.1 JP2.9 | 54.19,64.85 v47.65,71.39
D+  (via drill 0.2)
  Top 0.203: v2.85,43.29 2.85,44.45 IC7.15 | v12.36,43.83 14.4,43.83 21.25,36.98 21.25,28.36 22.67,26.94 22.67,13.42 17.87,8.62 USB.D+
  Bottom 0.203: v2.85,43.29 5.33,43.29 5.87,43.83 v12.36,43.83
D-  (via drill 0.2)
  Top 0.203: v6.67,34.85 5.96,34.85 4.27,36.54 4.27,40.01 3.47,40.8 3.47,44.45 IC7.16
  Route15 0.203: v6.67,34.85 11.38,30.14 11.38,13.96 16.8,8.53 16.8,6.4 17.78,5.42 USB.D-
DTR
  Top 0.203: C29.1 10.67,41.6 10.67,42.58 11.73,43.65 11.73,50.05 10.67,51.12 10.67,51.74 IC7.2
GND  (via drill 0.2, 0.3, 0.5)  (69 unrouted)
  Top 0.2: 29.25,23.82 30.12,24.7 IC$1.GND_31
  Top 0.203: C47.- 66.67,65.88 66.67,60.63 67.03,60.27 FP.4 67.03,60.19 64.99,58.14 64.99,47.83 65.52,47.3 RFID-READER.4 67.03,47.21 65.52,47.21 60.63,42.32 JP2.2 60.54,42.23 59.65,41.34 56.1,41.34 U3.11 56.01,41.25 53.87,41.25 53.43,41.69 53.43,42.05 53.52,42.14 53.52,44.63 52.72,45.43 52.72,47.47 R6.2 52.72,47.56 52.72,49.43 R7.2 52.72,49.52 52.72,51.47 C46.2 | C38.2 46.14,51.47 46.49,51.12 v47.12,51.12 47.21,51.12 47.56,51.47 48.09,51.47 C5.2 48.18,51.56 50.23,51.56 C9.2 50.32,51.56 52.27,51.56 C46.2 | C48.2 54.32,51.56 52.36,51.56 C46.2 | L20.C 59.3,10.49 55.74,10.49 53.52,8.27 C28.2 53.34,8.18 53.34,6.76 52.63,6.04 52.63,4.62 | C1.1 58.59,5.42 58.59,2.67 C30.1 58.59,2.49 57.87,1.78 56.19,1.78 55.47,2.49 53.52,2.49 C27.1 53.43,2.67 53.43,2.85 52.63,3.65 52.63,4.62 | C22.1 40.45,15.29 v40.45,14.31 40.45,12.09 47.03,5.51 R29.1 47.12,5.42 47.92,4.62 52.63,4.62 | 58.76,21.6 58.76,17.96 60.01,16.71 60.01,16.54 C45.2 | 58.76,21.6 60.01,22.85 U1.2 60.1,22.94 61.61,22.94 66.59,27.91 SENSOR.4 67.03,27.56 66.67,27.91 66.67,33.78 C26.- | 58.76,21.6 58.67,21.6 57.43,22.85 53.78,22.85 U1.4 53.78,22.94 53.78,26.14 45.96,33.96 41.6,33.96 C6.2 41.52,34.05 40.98,34.05 39.29,35.74 | v41.07,24.89 39.56,24.89 IC$1.AGND | C35.1 48.54,91.83 52.81,91.83 53.07,91.57 55.03,91.57 56.45,90.14 56.45,88.01 55.65,87.21 C41.2 | 55.09,86.53 53.7,87.92 52.54,87.92 52.36,87.74 52.36,87.3 51.74,86.68 50.58,86.68 49.7,85.79 49.25,85.79 R35.1 49.16,85.79 47.65,87.3 47.65,87.48 C40.1 47.56,87.3 v45.43,87.3 | 39.29,55.12 39.03,55.12 38.32,54.41 36.18,54.41 35.47,53.7 35.47,52.9 IC6.32
  Top 0.203: 39.29,55.12 42.85,55.12 U$4.A | 38.05,82.77 37.98,82.69 | OC1.11 46.05,73.7 46.58,73.7 47.38,74.5 47.38,75.39 46.58,76.19 46.05,76.19 OC1.9 45.96,76.28 44.9,76.28 43.65,77.52 42.58,77.52 42.05,78.05 41.69,78.05 41.47,77.83 | 29.25,61.96 32.18,61.96 33.16,62.94 ICSP.6 33.34,63.03 33.6,63.3 36.72,63.3 U$1.A | 29.25,61.96 28.09,61.96 25.87,59.74 25.51,59.74 U$5.A | 39.74,64.01 37.43,64.01 36.8,63.39 U$1.A | 39.74,64.01 49.43,64.01 Z2.3 | 37.52,60.36 37.52,62.41 36.72,63.21 U$1.A | 37.52,60.36 37.52,56.98 Y1.2 | 41.47,77.83 39.74,76.1 39.74,64.01 | 26.98,65.74 29.25,63.48 29.25,61.96 | 26.98,65.74 25.25,67.47 23.74,67.47 U3V12F12.2 23.56,67.47 22.94,67.47 17.34,61.87 IC8.5 17.25,61.87 16,63.12 10.76,63.12 | v41.16,80.19 42.05,80.19 C34.1 | 41.47,77.83 v41.16,78.14 | 26.98,65.74 29.96,68.72 29.96,69.16 27.83,71.3 27.83,72.45 C44.- | 39.29,55.12 39.29,59.92 38.85,60.36 37.52,60.36 | C23.1 25.69,31.11 25.69,29.87 26.58,28.98 IC$1.PGND_2 | 28.85,15.87 29.07,16.09 29.07,22.14 28.32,22.89 | 28.85,15.87 28.36,15.38 27.47,15.38 27.38,15.47 25.51,15.47 C24.1 | 28.32,22.89 28.27,22.94 26.67,22.94 IC$1.DGND | 28.32,22.89 29.25,23.82 | 28.85,15.87 34.8,9.91 | 34.8,9.91 37.6,7.11 C31.- | 34.8,9.91 30.94,6.04 18.76,6.04 16.18,8.62 15.47,8.62 USB.GND 15.38,8.62 9.34,14.67 U2.M1 9.25,14.67 8.53,13.96 3.2,13.96 1.78,15.38 1.33,15.38 U2.D4 1.6,15.47 1.6,29.34 U2.D2 1.69,29.43 2.13,29.43 3.56,30.85 8.45,30.85 9.25,30.05 U2.M2 9.16,30.23 13.34,34.4 13.96,34.4 18.34,34.4 U$3.A 20.36,36.54 16.54,36.54 13.34,39.74 C15.2 13.25,39.83 12.8,39.83 12.09,40.54 10.49,40.54 9.78,41.25 9.78,44.54
  Top 0.203: v30.05,92.99 30.05,93.35 | 12+PWR.P2 3.73,80.99 3.73,81.79 1.25,84.28 1.25,88.1 2.76,89.61 C4.- 2.85,89.61 5.33,89.61 7.56,87.39 10.31,87.39 v10.44,87.37 | 10.95,86.86 16.18,92.1 DC2DC_1.2 | U3.18 48.81,41.25 48.09,41.25 47.74,40.89 47.74,39.65 48.09,39.29 48.72,39.29 U3.21 48.81,39.29 48.81,38.67 U3.22 48.9,38.58 50.94,38.58 | 50.94,38.58 54.05,35.47 56.01,35.47 U3.2 | 39.29,35.74 38.23,35.74 37.96,36.01 37.96,36.8 IC6.99 37.96,36.89 37.96,37.6 37.69,37.87 29.16,37.87 | 41.87,43.2 41.34,43.74 40.45,43.74 IC6.11 | 41.87,43.2 41.87,38.41 39.29,35.83 39.29,35.74 | C21.1 40.36,31.2 36.45,31.2 33.87,33.78 31.2,33.78 28.98,36.01 28.98,36.8 IC6.81 28.98,36.89 28.98,37.69 29.16,37.87 | 50.94,38.58 50.94,40.98 51.03,41.07 51.03,42.32 49.61,43.74 42.49,43.74 41.96,43.2 41.87,43.2 | 9.78,44.54 9.96,44.54 IC7.26 | 9.78,44.54 9.34,44.54 IC7.25 9.34,44.63 9.34,45.07 8.89,45.52 7.11,45.52 6.76,45.16 6.76,44.54 IC7.21 6.67,44.45 6.67,43.03 6.22,42.58 5.87,42.58 4.8,43.65 4.8,44.45 IC7.18 4.8,44.54 4.8,48.63 7.29,51.12 7.29,51.74 IC7.7 7.38,51.83 7.38,54.05 8.62,55.3 U$10.GND2 | 10.76,63.12 9.87,63.12 9.78,63.03 U$10.4 9.87,63.21 8.71,64.36 8.71,71.65 U$10.GND1 | 19.11,51.83 20,51.83 C11.2 20,51.74 20,49.25 C12.2 20.09,49.16 20.09,46.49 C13.2 20.18,46.49 21.34,45.34 24.36,45.34 IC6.62 24.54,45.34 25.69,45.34 26.4,44.63 26.4,40.98 29.16,38.23 29.16,37.87 | 19.11,51.83 16.36,51.83 C10.2 16.36,51.92 16.36,52.27 15.38,53.25 15.38,54.41 15.11,54.67 14.05,54.67 12.18,52.81 12.09,52.81 | v19.11,51.65 19.11,51.83 | 12.09,52.81 12.09,52.72 15.65,49.16 15.65,44.27 PWR-LED.C
  Top 0.203: 12.09,52.81 9.51,55.38 8.71,55.38 U$10.GND2 | 10.76,63.12 10.76,56.72 9.51,55.47 U$10.GND2
  Top 0.3: C4.- v2.76,91.88 | v21.84,94.51 21.84,93 C42.1 21.83,92.61 C43.1 21.84,91.5 C37.1 21.85,89.64 C36.1 21.85,84.79 v20.82,83.76 | IC$2.PGND_2 30.05,93.35 30.79,93.35 IC$2.GND_29 | IC$2.DGND 31.78,87.5 IC$2.GND_32 | IC$2.GND_1 37.98,82.69 38.37,82.3 IC$2.PGND_1 42.19,81.13 C34.1 | IC$2.AGND 37.36,89.45 IC$2.GND_5 | L21.C 54.64,86.07 55.09,86.53 C41.2 | R38.2 11.46,86.35 10.95,86.86 v10.44,87.37 | v20.82,83.76 CC1.- | v20.82,83.76 v20.81,83.77
  Bottom 0.203: M-SENSOR.3 67.03,74.68 64.99,72.63 64.99,62.32 67.03,60.27 FP.4 | v47.12,51.12 47.47,50.76 47.47,50.41 U$2.3 | 61.78,31.03 61.96,30.85 Y2.4 | 61.78,31.03 61.7,31.11 61.7,33.07 C7.2 61.61,33.16 61.61,40.63 60.63,41.6 60.63,42.23 JP2.2 | 61.78,31.03 59.74,28.98 Y2.2 59.65,28.89 58.59,27.83 58.59,27.38 59.3,26.67 59.92,26.67 C14.2 60.01,26.58 60.01,23.38 60.27,23.11 IC2.13 60.27,23.02 60.27,19.29 59.38,18.4 59.38,18.31 | 61.78,31.03 Y2.4 | IC2.1 61.52,16.98 60.36,16.98 IC2.2 60.36,17.07 60.36,17.34 59.38,18.31 | 59.38,18.31 58.67,18.31 57.7,17.34 57.7,17.07 IC2.4 57.7,16.98 56.54,16.98 IC2.5 56.45,16.89 56.45,16.45 55.65,15.65 54.76,15.65 53.96,16.45 53.96,16.89 IC2.7 53.87,16.98 45.96,24.89 v41.07,24.89 41.07,24.8 40.45,24.18 v40.45,14.31 | SENSOR.4 65.25,27.56 62.05,30.76 Y2.4 | v41.16,78.14 v41.16,80.19 41.16,83.21 45.25,87.3 v45.43,87.3 | U2.8 14.94,17.87 12.45,17.87 9.34,14.76 U2.M1 | 16.62,10.05 16.62,9.87 15.38,8.62 USB.GND | 16.62,10.05 16.62,11.47 C25.2 | 16.62,10.05 23.47,10.05 30.14,3.38 31.29,3.38 C39.2 | v30.05,92.99 23.38,92.99 21.87,94.5 v21.84,94.51 21.78,94.5 18.58,94.5 16.27,92.19 DC2DC_1.2 | v19.11,51.65 20.27,51.65 EM_GND.1 | C17.1 9.42,34.58 9.42,36.98 C18.2 9.34,37.07 9.34,39.56 C16.2 9.42,39.65 9.42,40.09 12.98,43.65 12.98,51.12 8.71,55.38 U$10.GND2 | 12+PWR.P2 3.82,80.9 4.27,80.9 6.84,78.32 6.84,73.52 8.62,71.74 U$10.GND1
  Bottom 0.3: R4.1 20.04,80.15 20.84,80.95 20.84,83.74 v20.81,83.77
  pour Route2: -6.88,101.67 74.04,101.67 74.04,-4.8 -6.88,-4.8
GNDMOT_NC
  Bottom 0.406: EM_GND.3 15.29,51.65 15.29,57.61 16.27,58.59 16.27,61.34 16,61.61 10.4,61.61 9.78,60.98 U$10.2
INT  (via drill 0.2)
  Top 0.203: v31.83,35.03 31.91,35.12 31.91,36.8 IC6.87 | v40.27,35.56 45.34,35.56 56.36,24.54 v57.07,24.54
  Bottom 0.203: v31.83,35.03 34.94,35.03 35.03,34.94 39.65,34.94 v40.27,35.56 | v57.07,24.54 57.07,24.27 57.7,23.65 57.7,23.11 IC2.11
INT_3V3  (via drill 0.2)
  Top 0.203: v57.34,36.18 56.9,36.63 56.1,36.63 U3.4
  Bottom 0.203: v57.34,36.18 57.34,25.25 59.03,23.56 59.03,23.11 IC2.12
L-SENSOR  (via drill 0.2)
  Top 0.203: v52.54,26.58 46.76,32.36 40.27,32.36 39.03,33.6 39.03,33.87 36.98,35.92 36.98,36.8 IC6.97
  Route15 0.203: v52.54,26.58 60.45,26.58 67.03,20 SENSOR.1
LEDA  (via drill 0.2)
  Top 0.203: v50.58,33.87 50.58,34.31 49.52,35.38 48.9,35.38 U3.27
  Route2 0.203: v50.58,33.87 35.12,33.87 29.87,39.12 26.05,39.12 12.27,25.34 10.85,25.34 3.2,17.69 3.2,15.47 U2.D3
LEDB  (via drill 0.2)
  Top 0.203: v50.05,36.36 49.78,36.09 48.9,36.09 U3.26
  Route2 0.203: v50.05,36.36 33.16,36.36 30.05,39.47 16.98,39.47 8.98,31.47 5.51,31.47 3.47,29.43 U2.D1
M1-SENSOR
  Top 0.3: R15.2 61.72,75.95 62.98,77.21 M-SENSOR.2
M1_1A  (via drill 0.3)
  Top 0.3: IC$1.OUT1A_2 IC$1.OUT1A_1 38.01,18.43 v36.94,17.36
  Route2 0.3: v36.94,17.36 36.94,13.4 41.17,9.17 67.03,9.17 MOTOR_1.1
M1_1B  (1 unrouted)
  Top 0.9: IC$1.OUT1B_2 39.56,28.8 43.56,28.8 56.1,16.27 57.78,16.27 59.56,14.49 66.76,14.49 67.03,14.22 MOTOR_1.3
M1_2A  (via drill 0.6)
  Top 0.3: IC$1.OUT2A_1 IC$1.OUT2A_2
  Top 0.9: v27.91,16.54 26.67,17.78 IC$1.OUT2A_2
  Bottom 0.9: v27.91,16.54 28.8,16.54 33.6,11.73 67.03,11.73 MOTOR_1.2
M1_2B  (via drill 0.3)
  Top 0.2: IC$1.OUT2B_1 28.03,28.18 v29.38,29.53
  Top 0.3: IC$1.OUT2B_2 IC$1.OUT2B_1
  Route2 0.2: v29.38,29.53 29.38,16.54 37.89,8.03 62.21,8.03 v63.28,6.96
  Route15 0.2: v63.28,6.96 63.28,15.66 64.4,16.78 67.04,16.78 MOTOR_1.4
M2-SENSOR  (via drill 0.5)
  Top 0.3: R2.2 v61,73.91
  Bottom 0.3: v61,73.91 61,75.1 65.59,79.69 66.99,79.69 M-SENSOR.1
M2_1A  (via drill 0.5)
  Top 0.3: IC$2.OUT1A_2 IC$2.OUT1A_1 42.31,82.95 v42.98,82.93
  Bottom 0.3: MOTOR_2.1 67.03,83.03 47.22,83.03 47.12,82.93 v42.98,82.93
M2_1B
  Top 0.3: IC$2.OUT1B_2 IC$2.OUT1B_1 43.58,92.7 45.76,94.88 55.41,94.88 62.18,88.11 67.03,88.11 MOTOR_2.3
M2_2A
  Top 0.3: IC$2.OUT2A_1 IC$2.OUT2A_2 28.37,82.3 32.04,78.63 37.52,78.63 38.04,79.15 45.87,79.15 45.89,79.13 50.54,83.78 55.9,83.78 57.72,85.6 MOTOR_2.2
M2_2B
  Top 0.3: IC$2.OUT2B_2 IC$2.OUT2B_1 26.61,92.7 26.2,93.11 26.2,93.72 26.49,94.01 30.63,94.01 32.85,96.23 55.71,96.23 61.29,90.65 67.03,90.65 MOTOR_2.4
M8RXD  (via drill 0.2)
  Top 0.203: v14.4,47.21 14.4,48.63 11.29,51.74 IC7.1
  Bottom 0.203: v14.4,47.21 19.02,42.58 20,42.58 R27.1
M8TXD  (via drill 0.2)
  Top 0.203: v15.02,45.78 15.02,49.25 11.73,52.54 11.73,52.63 11.56,52.81 9.07,52.81 8.71,52.45 8.71,51.83 IC7.5
  Bottom 0.203: v15.02,45.78 19.11,41.69 20.62,41.69 20.8,41.87 20.8,43.2 20.09,43.92 20.09,45.07 R26.1
MISO_1  (via drill 0.2)
  Top 0.203: v29.69,89.43 28.18,89.43 IC$2.SDO | v45.07,50.76 42.67,50.76 41.25,49.34 40.45,49.34 IC6.22 | v28.63,27.47 28.8,27.29 28.8,25.43 28.36,24.98 26.67,24.98 IC$1.SDO
  Route2 0.203: v53.61,36.89 45.78,44.72 45.78,50.05 v45.07,50.76
  Route15 0.203: v28.63,27.47 28.63,27.65 29.87,28.89 31.03,28.89 31.2,29.07 31.2,31.47 34.67,34.94 51.65,34.94 v53.61,36.89
  Bottom 0.203: v29.69,89.43 30.4,89.43 30.85,88.99 30.85,87.66 28.71,85.52 28.71,68.81 33.43,64.1 33.69,64.1 34.31,63.48 34.31,60.1 33.6,59.38 | 33.6,59.38 32.8,59.38 31.74,60.45 31.74,60.98 31.2,61.52 29.16,61.52 28.18,60.54 ICSP.1 | U$2.2 46.23,50.76 v45.07,50.76 39.74,50.76 33.6,56.9 33.6,59.38 | v53.61,36.89 53.87,36.63 53.87,23.11 IC2.8
MOSI_1  (via drill 0.2)
  Top 0.203: v29.69,88.19 28.18,88.19 IC$2.SDI | R40.2 46.14,49.52 45.87,49.78 v45.16,49.78 42.23,49.78 41.34,48.9 40.45,48.9 IC6.21 40.36,48.81 39.65,48.81 38.23,47.38 v38.23,43.92 | v28.18,23.56 26.67,23.56 IC$1.SDI
  Route15 0.203: v28.18,23.56 28.8,24.18 28.8,26.49 28,27.29 28,32.36 38.23,42.58 v38.23,43.92
  Bottom 0.203: v29.69,88.19 29.69,87.57 28,85.88 28,65.7 30.67,63.03 ICSP.4 30.14,63.48 28.18,61.52 27.65,61.52 25.51,59.38 25.51,55.03 36.63,43.92 v38.23,43.92 | v45.16,49.78 46.23,49.78 U$2.1
N$1
  Top 0.203: PWR-LED.A 17.25,44.18 20,44.18 R18.1
N$2
  Top 0.203: RC2.1 57.52,69.88 56.27,69.88 53.78,67.39 53.25,67.39 OC1.1
N$3
  Top 0.203: R22.2 42.41,68.01 45.43,68.01 45.96,68.54 OC1.15
N$4  (via drill 0.2)
  Top 0.203: v2.58,34.49 3.38,34.49 D13.A
  Bottom 0.203: v2.58,34.49 3.91,34.49 R19.1
N$5
  Top 0.203: RC4.1 57.52,71.83 55.74,71.83 53.87,69.96 53.25,69.96 OC1.3
N$6  (via drill 0.2)
  Top 0.203: v2.58,39.65 3.38,39.65 TX.A
  Bottom 0.203: v2.58,39.65 3.91,39.65 R21.2
N$7
  Top 0.203: R5.2 42.41,70.05 44.36,70.05 45.43,71.12 45.96,71.12 OC1.13
N$8
  Top 0.203: R5.1 40.72,69.96 40.72,69.61 41.52,68.81 44.45,68.81 44.81,69.16 47.3,69.16 50.49,65.96 50.49,62.05 49.52,61.07 Z2.1
N$9
  Top 0.3: OC1.8 57.29,76.23 R15.1
N$10
  Top 0.3: OC1.6 57.35,73.69 R2.1
N$11  (via drill 0.25)
  Top 0.406: v14.94,66.05 15.2,66.32 16.36,66.32 Z3.2 | v40.36,66.14 42.05,66.14 43.2,67.3 45.96,67.3 OC1.16
  Route15 0.406: v40.36,66.14 39.38,66.14 39.12,66.41 24.18,66.41 23.91,66.14 15.02,66.14 v14.94,66.05
  Bottom 0.406: v14.94,66.05 14.94,64.36 17.69,61.61 17.69,60.01 EM_PWR.2
N$12  (via drill 0.2)
  Top 0.203: v40.36,66.94 40.63,67.21 40.63,67.92 R22.1 | v29.34,68.99 17.25,68.99 16.18,67.92 Z3.1
  Bottom 0.203: v40.36,66.94 31.38,66.94 v29.34,68.99
N$13  (via drill 0.25)
  Top 0.406: v22.4,71.3 21.69,70.59 18.22,70.59 RC1.1
  Bottom 0.406: v22.4,71.3 24.8,71.3 25.6,70.5 25.6,60.19 17.78,52.36 17.78,51.65 EM_GND.2
N$14  (via drill 0.3)
  Top 0.3: R38.1 6.84,85.21 D3.A 6.76,86.25 v5.64,87.37
  Bottom 0.3: v5.64,87.37 5.64,87.33 7.31,85.66 7.31,77.61 8.61,76.31 9.92,76.31 PFET-M.1
N$15
  Top 0.203: R7.1 54.41,49.43 54.41,47.56 R6.1 54.41,47.47 56.01,45.87 56.01,43.2 U3.14
N$16
  Top 0.203: D4.2 53.87,14.58 53.16,13.87 48.81,13.87 C19.1 48.81,13.96 48.81,18.49 41.07,26.23 39.56,26.23 IC$1.VBOOT
N$17
  Top 0.203: C20.1 46.94,11.65 46.94,12.45 44.01,15.38 44.01,22.76 41.25,25.51 39.56,25.51 IC$1.CP
N$18
  Top 0.203: C20.2 48.81,11.65 54.14,11.65 54.85,12.36 D4.3
N$19
  Top 0.203: L20.A 59.3,11.91 56.01,11.91 53.07,8.98 47.83,8.98 47.12,8.27 R30.1
N$20
  Top 0.203: C28.1 51.74,8.27 48.81,8.27 R30.2 48.72,8.18 48.45,8.18 47.65,7.38 46.41,7.38 43.65,10.13 43.65,20.45 41.16,22.94 39.56,22.94 IC$1.VREG
N$21  (via drill 0.2)
  Top 0.203: v58.85,33.6 55.38,33.6 51.03,37.96 48.9,37.96 U3.23
  Bottom 0.203: Y2.3 59.74,30.85 59.92,31.03 59.92,33.07 C7.1 59.83,33.07 59.3,33.6 v58.85,33.6
N$22
  Bottom 0.203: R37.1 15.02,14.94 15.02,13.16 R32.1 15.02,13.07 16.54,13.07 16.62,13.16 C25.1 16.71,13.16 16.89,12.98 18.31,12.98 R24.1 18.31,13.07 18.31,14.94 R31.1
N$23
  Top 0.203: L1.1 12.98,31.91 12.98,29.78 14.67,28.09 14.67,26.67 13.96,25.96 13.96,24.09 14.94,23.11 U2.4
  Bottom 0.203: R17.2 36.54,1.69 34.58,1.69 R23.2 34.49,1.69 32.18,1.69 | R12.2 26.31,1.69 28.18,1.69 R8.2 28.36,1.69 31.29,1.69 C39.1 31.38,1.69 32.18,1.69 | 32.18,1.69 32.18,7.11 16.27,23.02 15.02,23.02 U2.4
N$24
  Top 0.3: R36.1 53.12,85.06 L21.A
N$25  (via drill 0.2)
  Top 0.203: v59.21,27.56 57.78,27.56 57.52,27.83 57.52,29.07 54.85,31.74 54.85,32.36 49.87,37.34 48.9,37.34 U3.24
  Bottom 0.203: 61.7,27.56 61.7,28.63 61.96,28.89 Y2.1 | 61.7,27.56 61.7,26.67 C14.1 | 61.7,27.56 v59.21,27.56
N$26  (via drill 0.2)
  Top 0.203: R1.1 16.27,53.87 16.27,57.25 15.91,57.61 15.91,59.74 16.71,60.54 17.25,60.54 IC8.6 16.71,60.63 15.82,61.52 v15.82,62.5
  Route2 0.203: v16.8,75.12 18.22,73.7 18.22,64.9 v15.82,62.5
  Bottom 0.203: v16.8,75.12 16.8,79.83 R10.2
N$27  (via drill 0.2)
  Top 0.203: v18.76,62.41 18.76,60.19 17.87,59.3 17.34,59.3 IC8.7
  Bottom 0.203: R11.2 16.89,81.97 16.89,83.03 17.69,83.83 17.69,84.99 17.96,85.25 19.02,85.25 19.29,84.99 19.29,82.14 19.02,81.88 R4.2 18.94,81.79 18.14,80.99 18.14,74.14 18.76,73.52 v18.76,62.41
N$28  (via drill 0.2)
  Top 0.203: v2.58,37.07 3.38,37.07 RX.A
  Bottom 0.203: v2.58,37.07 3.91,37.07 R20.2
N$29  (via drill 0.2)
  Top 0.203: v26.14,55.21 25.16,55.21 R44.1 | v49.07,45.61 53.07,41.6 53.07,41.52 54.59,40.01 56.01,40.01 U3.9 | v45.43,38.32 45.43,36.01 53.78,27.65 55.03,27.65 55.83,28.45 56.1,28.45 R43.1
  Bottom 0.203: v26.14,55.21 29.6,55.21 37.16,47.65 41.78,47.65 43.83,45.61 45.43,45.61 | v49.07,45.61 45.43,45.61 | 45.43,45.61 v45.43,38.32
N$34  (via drill 0.2)
  Top 0.203: v52.27,45.07 47.92,49.43 R40.1 | v52.9,40.36 53.16,40.36 54.85,38.67 56.01,38.67 U3.7
  Bottom 0.203: v52.27,45.07 52.27,40.98 v52.9,40.36
N$36
  Top 0.203: R39.1 47.92,47.47 47.92,45.96 52.9,40.98 53.07,40.98 54.67,39.38 56.01,39.38 U3.8
N$39
  Top 0.203: U3.1 56.1,34.67 60.36,34.67 61.16,33.87 C26.+
N$55
  Top 0.3: IC$2.VBOOT 45.49,90.75 C32.1 47.53,92.79 53.45,92.79 D5.2
N$56
  Top 0.3: IC$2.CP C33.1
N$57
  Top 0.3: C33.2 52.51,90.1 52.68,90.1 53.98,90.1 D5.3
N$59
  Top 0.3: C41.1 53.13,88.77 R36.2 | IC$2.VREG 42.63,87.5 44.26,89.13 52.77,89.13 R36.2 | R36.2
R-SENSOR  (via drill 0.2)
  Top 0.203: v53.16,25.96 52.36,25.96 46.32,32 40.09,32 38.67,33.43 38.67,33.69 36.45,35.92 36.45,36.8 IC6.96
  Route2 0.203: v53.16,25.96 63.56,25.96 67.03,22.49 SENSOR.2
RESET  (via drill 0.2)
  Top 0.203: R14.1 9.69,32.72 9.69,36.01 10.58,36.89 D1.A 10.67,36.98 10.67,39.74 C29.2 10.76,39.74 10.94,39.92 v11.91,39.92 | v12.71,40.72 13.25,41.25 13.25,41.52 C15.1 | v36.36,51.56 36.36,52.81 IC6.30 | v33.52,55.65 33.52,60.19 33.25,60.45 ICSP.5
  Route15 0.203: v12.71,40.72 13.07,40.72 14.4,39.38 16.45,39.38 26.58,49.52 26.58,51.56 30.67,55.65 v33.52,55.65
  Bottom 0.203: v11.91,39.92 v12.71,40.72 | v36.36,51.56 36.36,53.07 33.78,55.65 v33.52,55.65
RESET_1  (via drill 0.2)
  Top 0.203: C27.2 51.65,2.58 48.81,2.58 R25.1 48.72,2.49 48.45,2.49 47.65,1.69 46.49,1.69 39.56,8.62 39.56,16.09 39.65,16.18 41.07,16.18 41.25,16 41.25,14.76 41.43,14.58 42.76,14.58 42.94,14.76 42.94,18.67 40.63,20.98 40.63,21.07 | v29.69,38.49 29.69,41.87 25.25,46.32 24.45,46.32 IC6.60 | v41.07,21.69 41.07,21.51 40.63,21.07 | 40.63,21.07 39.56,21.07 IC$1.STBY/RST
  Route2 0.203: v29.69,38.49 29.69,37.96 40.45,27.2 40.45,22.31 v41.07,21.69
RESET_2  (via drill 0.2)
  Top 0.203: v25.51,53.78 25.51,47.12 25.25,46.85 24.45,46.85 IC6.59 | v42.67,85.52 42.67,85.55
  Top 0.3: IC$2.STBY/RST 42.67,85.55 45.42,85.55 R33.1 47.41,85.56 C40.2
  Route2 0.203: v25.51,53.78 25.51,67.47 42.67,84.63 v42.67,85.52
RFID-EN  (via drill 0.2)
  Top 0.203: v52.9,44.45 52.09,44.45 51.65,44.9 51.65,45.16 48.45,48.36 44.54,48.36 43.56,47.38 40.45,47.38 IC6.18
  Bottom 0.203: v52.9,44.45 58.67,44.45 60.1,45.87 61.25,45.87 64.9,42.23 67.03,42.23 RFID-READER.2
RFID-TX8  (via drill 0.2)
  Top 0.203: v6.67,34.05 6.22,34.49 4.98,34.49 D13.C | v34.67,50.94 37.34,50.94 38.41,52.01 38.41,52.81 IC6.26
  Route2 0.203: v6.67,34.05 9.87,34.05 15.73,39.92 23.65,39.92 v34.67,50.94
RS485-A
  Bottom 0.203: R10.1 15.11,79.83 15.11,78.5 13.42,76.81 13.42,76.1 15.02,74.5 RS-485.P1 | R9.2 18.4,84.37 18.4,82.68 17.69,81.97 17.69,75.21 16.98,74.5 15.11,74.5 RS-485.P1 | U$10.5 7.73,64.1 7.73,64.72 6.76,65.7 6.76,66.5 14.85,74.59 RS-485.P1
RS485-B
  Top 0.203: U$10.6 9.78,65.08 9.78,65.79 13.42,69.43 13.42,74.85 15.02,76.45 RS-485.P2
  Bottom 0.203: R9.1 16.71,84.37 15.2,82.86 15.2,81.97 R11.1 15.2,81.88 15.2,81.34 15.91,80.63 15.91,77.34 15.11,76.54 RS-485.P2
RS485-TX/RX  (via drill 0.2)
  Top 0.203: v24.36,51.47 24.36,50.85 IC6.51 | v24.36,57.96 23.11,59.21 22.49,59.21 IC8.2 22.49,59.3 IC8.3
  Bottom 0.203: v24.36,57.96 v24.36,51.47
RST
  Top 0.203: R41.1 58.41,28.54 58.67,28.54 62.85,32.72 63.03,32.72 63.21,32.89 63.21,34.76 57.43,40.54 56.1,40.54 U3.10
RX0  (via drill 0.2)
  Top 0.203: v29.87,42.49 36.18,42.49 39.29,39.38 40.36,39.38 IC6.2
  Bottom 0.203: v29.87,42.49 21.78,42.49 R27.2
RX1
  Top 0.203: IC6.45 28.89,52.9 28.89,53.7 26.49,56.1 24.36,56.1 22.49,57.96 IC8.1
RX2  (via drill 0.2)
  Top 0.203: v48.54,44.54 48.36,44.36 40.45,44.36 IC6.12
  Route2 0.203: v48.54,44.54 50.94,44.54 60.36,53.96 63.39,53.96 67.03,57.61 FP.3
RX3  (via drill 0.2)
  Top 0.203: v25.78,44.45 25.43,44.81 24.45,44.81 IC6.63
  Route15 0.203: v25.78,44.45 28.89,44.45 33.34,48.9 43.83,48.9 47.12,45.61 48.27,45.61 48.9,46.23 65.52,46.23 67.03,44.72 RFID-READER.3
RXL
  Top 0.203: RX.C 4.98,37.07 4.98,38.41 8,41.43 8,44.45 IC7.23
SCK_1  (via drill 0.2)
  Top 0.203: U$1.C 36.72,61.78 v32.8,61.78 32.54,61.78 31.29,60.54 30.76,60.54 ICSP.3 | v44.45,47.47 46.14,47.47 R39.2 | v41.69,48.27 40.45,48.27 IC6.20 | v28.18,24.36 26.67,24.36 IC$1.CK | v30.23,88.81 28.18,88.81 IC$2.CK
  Route15 0.203: v28.18,24.36 28.18,24.8 27.56,25.43 27.56,34.14 v41.69,48.27
  Bottom 0.203: v44.45,47.47 42.49,47.47 v41.69,48.27 30.76,59.21 30.76,60.45 ICSP.3 | v30.23,88.81 30.23,88.46 30.32,88.37 30.32,87.66 28.36,85.7 28.36,66.85 32.18,63.03 32.18,62.41 v32.8,61.78
SL1-ENABLE  (via drill 0.2)
  Top 0.203: v36.01,35.56 36.01,36.8 IC6.95 | v50.67,69.16 52.63,71.12 53.16,71.12 OC1.4
  Route2 0.203: v41.25,36.98 41.25,38.76 38.58,41.43 38.58,43.47 44.45,49.34 44.45,62.94 v50.67,69.16
  Bottom 0.203: v36.01,35.56 39.47,35.56 40.89,36.98 v41.25,36.98
SO_3V3  (via drill 0.2)
  Top 0.203: v54.85,37.52 55.3,37.96 56.01,37.96 U3.6
  Bottom 0.203: v54.85,37.52 54.85,23.47 55.21,23.11 IC2.9
SOL1-
  Top 0.203: Z2.2 49.16,62.5 49.16,62.23 48.45,61.52 48.45,59.83 50.23,58.05 D2.A 50.32,58.05 53.43,61.16 55.56,61.16 SOL.1
TPIN+  (via drill 0.2)
  Top 0.203: v54.05,41.87 54.67,42.49 56.01,42.49 U3.13 | v14.05,27.91 13.51,27.91 12.45,26.85 U2.1 12.36,26.76 11.38,25.78 11.38,18.85 13.25,16.98 v13.25,16.09
  Bottom 0.203: R32.2 13.25,13.07 13.25,14.94 R37.2 13.25,15.11 v13.25,16.09 | U$7.C 6.04,24 9.6,24 12.36,26.76 U2.1 | v54.05,41.87 54.05,40.72 50.32,36.98 46.49,36.98 41.6,32.09 28.71,32.09 22.14,25.51 16.45,25.51 v14.05,27.91
TPIN-  (via drill 0.2)
  Top 0.203: v54.85,41.87 56.01,41.87 U3.12 | v16.09,22.4 16.09,24.45 15.02,25.51 U2.2
  Bottom 0.203: 15.47,21.87 14.76,21.87 13.87,22.76 12,22.76 11.82,22.58 6.04,22.58 U$7.A | 15.47,21.87 19.91,17.42 19.91,15.02 R31.2 20,14.85 20,12.98 R24.2 | v54.85,41.87 54.85,40.36 46.23,31.74 28.89,31.74 22.31,25.16 15.38,25.16 15.02,25.51 U2.2 | v16.09,22.4 15.56,21.87 15.47,21.87
TPOUT+  (via drill 0.2)
  Top 0.203: v50.05,41.43 49.61,41.87 48.9,41.87 U3.17 | v20.62,26.14 16.27,21.78 12.45,21.78 U2.5
  Bottom 0.203: R8.1 28.18,3.38 26.31,3.38 R12.1 26.23,3.38 21.43,3.38 17.34,7.47 14.94,7.47 14.13,8.27 14.13,15.73 15.91,17.51 15.91,20.89 15.29,21.51 12.62,21.51 12.45,21.69 U2.5 12.36,21.69 11.91,21.25 6.04,21.25 U$6.C | v50.05,41.43 50.05,41.07 41.43,32.45 28.54,32.45 22.23,26.14 v20.62,26.14
TPOUT-  (via drill 0.2)
  Top 0.203: v47.56,41.96 48.09,42.49 48.81,42.49 U3.16 | 17.74,22.45 15.82,20.54 15.02,20.54 U2.6 | 17.74,22.45 v22.05,26.76 | 17.74,22.45 v22.05,18.14
  Bottom 0.203: R17.1 36.54,3.38 34.58,3.38 R23.1 34.58,3.47 34.58,5.6 v22.05,18.14 | U$6.A 6.04,19.74 11.56,19.74 12.27,20.45 14.94,20.45 U2.6 | v47.56,41.96 47.56,39.12 41.25,32.8 28.09,32.8 v22.05,26.76
TRAY_LOCK_CONTROL_EM  (via drill 0.25)
  Top 0.406: 14.22,67.74 14.22,65.79 15.02,64.99 16.09,64.99 Z3.3 | 14.22,67.74 16.62,70.14 RC1.2 16.54,70.5 17.51,69.52 23.2,69.52 23.65,69.96 U3V12F12.3 23.65,70.23 23.65,73.61 20.8,76.45 20.62,76.45 EMLOCK.P2 | v13.07,68.19 13.69,68.19 14.05,67.83 14.22,67.74
  Bottom 0.406: v13.07,68.19 9.25,68.19 7.82,66.76 7.82,66.14 U$10.7
TRAY_LOCK_CONTROL_UC  (via drill 0.2)
  Top 0.203: v21.25,56.81 22.58,55.47 22.58,51.38 23.56,50.41 24.36,50.41 IC6.52 | v51.3,68.54 53.16,68.54 OC1.2
  Route15 0.203: v51.3,68.54 43.65,68.54 40.09,64.99 23.74,64.99 U3V12F12.1
  Bottom 0.203: v21.25,56.81 21.25,57.7 23.65,60.1 23.65,64.9 U3V12F12.1
TRAY_LOCK_STATUS  (via drill 0.25)
  Top 0.406: v19.02,43.47 20,42.49 20,41.43 RC3.1
  Bottom 0.406: v19.02,43.47 19.02,47.92 16.71,50.23 16.71,56.45 18.76,58.5 | 18.76,58.5 18.76,61.43 15.65,64.54 15.65,66.32 14.94,67.03 9.78,67.03 U$10.8 | EMLOCK.P1 20.62,74.41 20.62,73.17 21.34,72.45 21.34,58.5 21.07,58.23 19.11,58.23 18.94,58.41 18.76,58.5
TRAY_LOCK_STATUS1
  Top 0.203: RC3.2 21.87,41.34 24.36,41.34 IC6.70
TX0  (via drill 0.2)
  Top 0.203: v27.29,45.07 34.4,45.07 39.65,39.83 40.36,39.83 IC6.3
  Bottom 0.203: v27.29,45.07 21.78,45.07 R26.2
TX1
  Top 0.203: IC6.46 28.36,52.9 28.36,53.7 27.65,54.41 24.45,54.41 21.43,57.43 21.25,57.43 21.07,57.61 21.07,60.9 21.96,61.78 22.4,61.78 IC8.4
TX2  (via drill 0.2)
  Top 0.203: v47.3,46.23 45.96,44.9 40.45,44.9 IC6.13
  Route15 0.203: v47.3,46.23 48.36,46.23 56.1,53.96 65.88,53.96 67.03,55.12 FP.2
TXL
  Top 0.203: TX.C 4.98,39.65 4.98,40.8 7.29,43.12 7.29,44.45 IC7.22
VMOT
  Bottom 0.406: EM_PWR.3 15.2,59.92 10.22,59.92 10.13,59.83 7.91,59.83 7.82,59.92 U$10.1
XTAL1  (via drill 0.2)
  Top 0.203: R13.1 36.72,59.47 36.72,57.16 36.54,56.98 Y1.3 36.45,56.9 36.45,56.36 34.67,54.59 v34.05,54.59 | v34.14,51.56 34.4,51.83 34.4,52.81 IC6.34
  Bottom 0.203: v34.14,51.56 34.14,54.5 v34.05,54.59
XTAL2
  Top 0.203: R13.2 38.58,59.47 38.58,56.98 Y1.1 38.58,56.9 38.58,55.21 38.14,54.76 36.01,54.76 34.94,53.7 34.94,52.9 IC6.33
XVCC
  Top 0.406: USB.VBUS 15.29,5.42 15.29,6.31 11.47,10.13 6.84,10.13 F1.2

## Text on the board
tValues: MF_TRAY_MB_V9